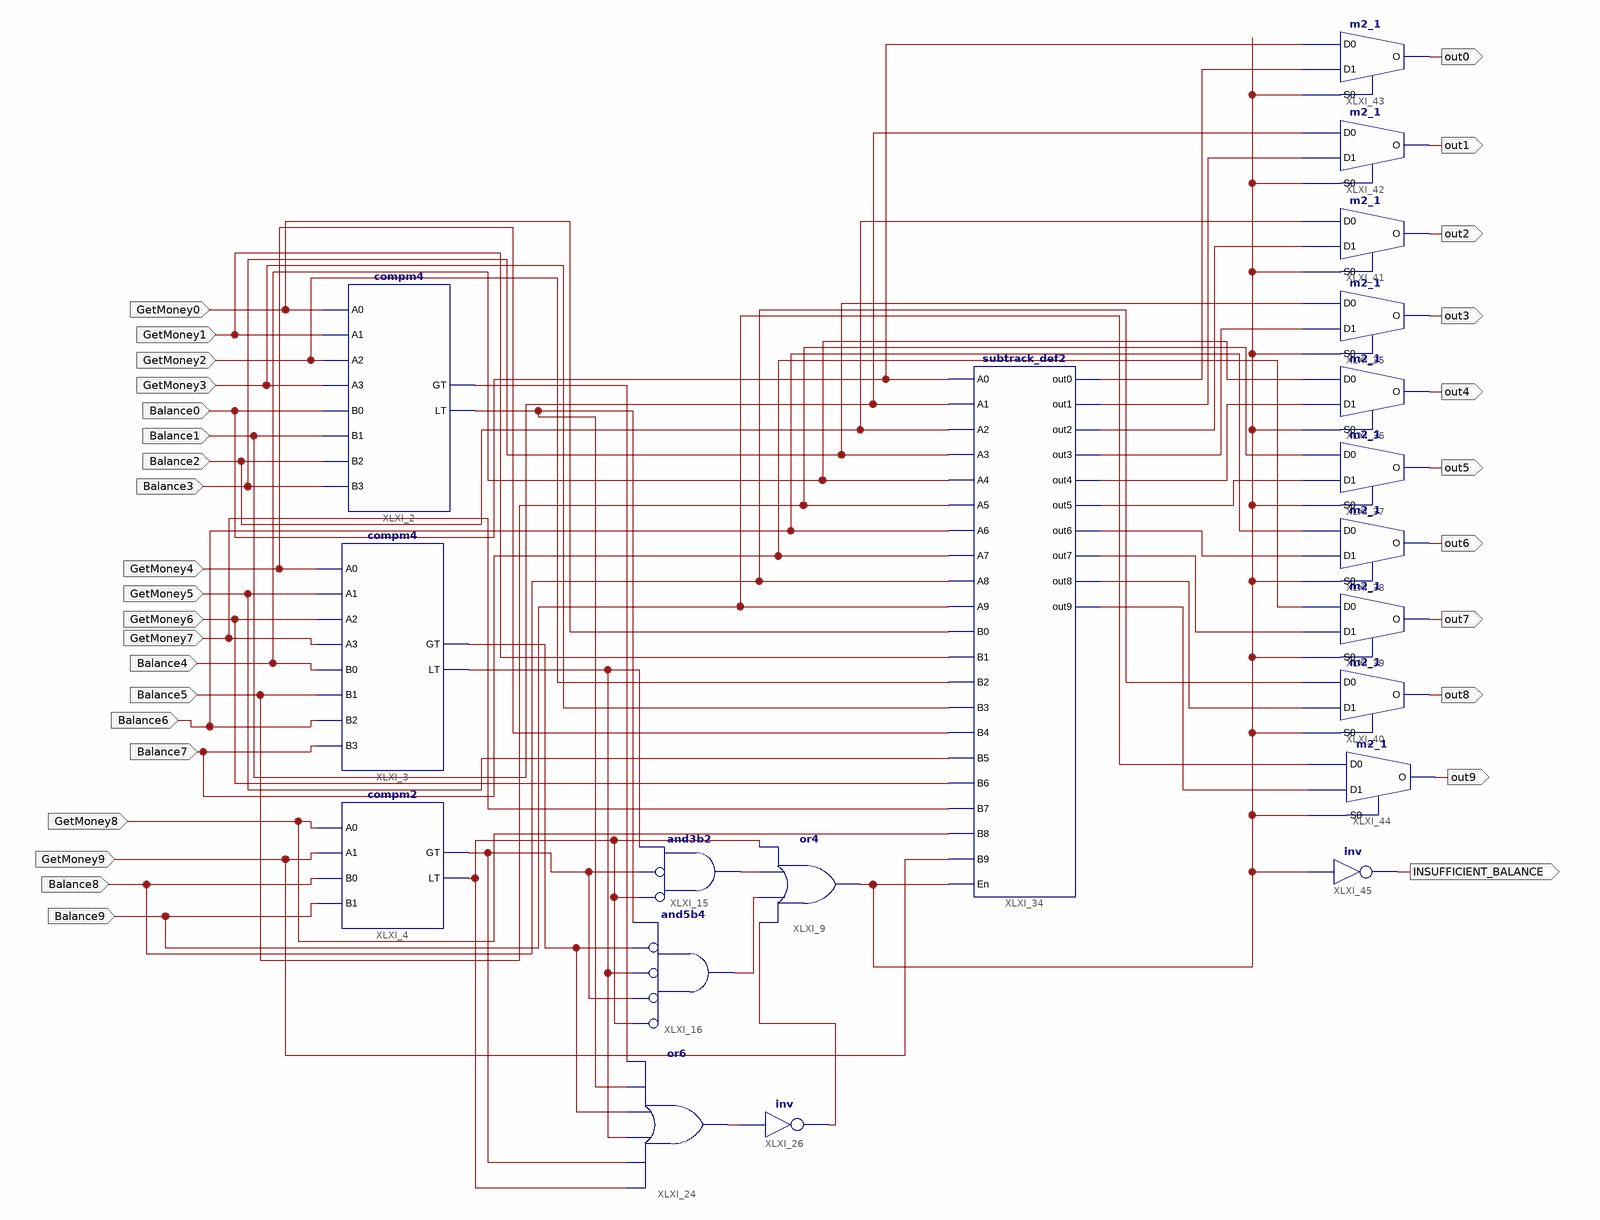
[diagram p0: schematic sheet 1]
// Xilinx ISE schematic Get_Money.sch (xc9500xl) as structural Verilog: 20 symbols, 31 ports
module Get_Money (
  input  GetMoney0,
  input  GetMoney3,
  input  Balance0,
  input  Balance1,
  input  Balance2,
  input  Balance3,
  input  GetMoney4,
  input  GetMoney5,
  input  GetMoney6,
  input  GetMoney7,
  input  Balance4,
  input  Balance5,
  input  Balance6,
  input  Balance7,
  input  GetMoney8,
  input  Balance8,
  input  Balance9,
  input  GetMoney2,
  input  GetMoney1,
  input  GetMoney9,
  output out0,
  output out1,
  output out2,
  output out3,
  output out4,
  output out5,
  output out6,
  output out7,
  output out8,
  output out9,
  output INSUFFICIENT_BALANCE
);

  wire XLXN_13, XLXN_14, XLXN_28, XLXN_29, XLXN_72, XLXN_74, XLXN_75, XLXN_76, XLXN_78, XLXN_82, XLXN_83,
       XLXN_84, XLXN_85, XLXN_86, XLXN_87, XLXN_88, XLXN_89, XLXN_90, XLXN_91, XLXN_92, XLXN_93;

  compm4 XLXI_2 (
    .A0(GetMoney0), .A1(GetMoney1), .A2(GetMoney2), .A3(GetMoney3), .B0(Balance0), .B1(Balance1),
    .B2(Balance2), .B3(Balance3), .GT(XLXN_75), .LT(XLXN_74));
  compm4 XLXI_3 (
    .A0(GetMoney4), .A1(GetMoney5), .A2(GetMoney6), .A3(GetMoney7), .B0(Balance4), .B1(Balance5),
    .B2(Balance6), .B3(Balance7), .GT(XLXN_76), .LT(XLXN_72));
  compm2 XLXI_4 (.A0(GetMoney8), .A1(GetMoney9), .B0(Balance8), .B1(Balance9), .GT(XLXN_78), .LT(XLXN_82));
  and XLXI_16 (XLXN_14, ~XLXN_82, ~XLXN_78, ~XLXN_72, ~XLXN_76, XLXN_74);  // and5b4
  or XLXI_24 (XLXN_28, XLXN_82, XLXN_78, XLXN_72, XLXN_76, XLXN_74, XLXN_75);
  not XLXI_26 (XLXN_29, XLXN_28);
  or XLXI_9 (XLXN_83, XLXN_29, XLXN_14, XLXN_13, XLXN_82);
  and XLXI_15 (XLXN_13, ~XLXN_82, ~XLXN_78, XLXN_72);  // and3b2
  subtrack_def2 XLXI_34 (
    .A0(Balance0), .A1(Balance1), .A2(Balance2), .A3(Balance3), .A4(Balance4), .A5(Balance5), .A6(Balance6),
    .A7(Balance7), .A8(Balance8), .A9(Balance9), .B0(GetMoney0), .B1(GetMoney1), .B2(GetMoney2),
    .B3(GetMoney3), .B4(GetMoney4), .B5(GetMoney5), .B6(GetMoney6), .B7(GetMoney7), .B8(GetMoney8),
    .B9(GetMoney9), .En(XLXN_83), .out0(XLXN_84), .out1(XLXN_85), .out2(XLXN_86), .out3(XLXN_87),
    .out4(XLXN_88), .out5(XLXN_89), .out6(XLXN_90), .out7(XLXN_91), .out8(XLXN_92), .out9(XLXN_93));
  m2_1 XLXI_35 (.D0(Balance3), .D1(XLXN_87), .S0(XLXN_83), .O(out3));
  m2_1 XLXI_36 (.D0(Balance4), .D1(XLXN_88), .S0(XLXN_83), .O(out4));
  m2_1 XLXI_37 (.D0(Balance5), .D1(XLXN_89), .S0(XLXN_83), .O(out5));
  m2_1 XLXI_38 (.D0(Balance6), .D1(XLXN_90), .S0(XLXN_83), .O(out6));
  m2_1 XLXI_39 (.D0(Balance7), .D1(XLXN_91), .S0(XLXN_83), .O(out7));
  m2_1 XLXI_40 (.D0(Balance8), .D1(XLXN_92), .S0(XLXN_83), .O(out8));
  m2_1 XLXI_41 (.D0(Balance2), .D1(XLXN_86), .S0(XLXN_83), .O(out2));
  m2_1 XLXI_42 (.D0(Balance1), .D1(XLXN_85), .S0(XLXN_83), .O(out1));
  m2_1 XLXI_43 (.D0(Balance0), .D1(XLXN_84), .S0(XLXN_83), .O(out0));
  m2_1 XLXI_44 (.D0(Balance9), .D1(XLXN_93), .S0(XLXN_83), .O(out9));
  not XLXI_45 (INSUFFICIENT_BALANCE, XLXN_83);
endmodule
